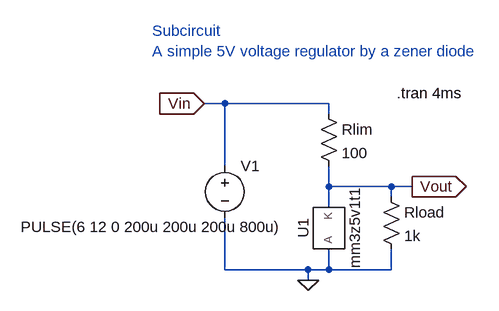
[diagram p0: schematic LTspice 06-2 Subcircuit.asc]
LTspice 06-2 Subcircuit.asc, the LTspice schematic file:
Version 4
SHEET 1 2152 1224
WIRE 368 192 336 192
WIRE 528 192 368 192
WIRE 528 208 528 192
WIRE 368 288 368 192
WIRE 528 320 528 288
WIRE 624 320 528 320
WIRE 656 320 624 320
WIRE 624 336 624 320
WIRE 528 352 528 320
WIRE 368 448 368 368
WIRE 496 448 368 448
WIRE 528 448 528 416
WIRE 528 448 496 448
WIRE 624 448 624 416
WIRE 624 448 528 448
WIRE 496 464 496 448
FLAG 496 464 0
FLAG 656 320 Vout
IOPIN 656 320 Out
FLAG 336 192 Vin
IOPIN 336 192 In
SYMBOL res 512 192 R0
SYMATTR InstName Rlim
SYMATTR Value 100
SYMBOL voltage 368 272 R0
WINDOW 3 -314 110 Left 2
WINDOW 123 0 0 Left 2
WINDOW 39 0 0 Left 2
SYMATTR Value PULSE(6 12 0 200u 200u 200u 800u)
SYMATTR InstName V1
SYMBOL res 608 320 R0
SYMATTR InstName Rload
SYMATTR Value 1k
SYMBOL mm3z5v1t1 528 384 R270
SYMATTR InstName U1
TEXT 256 80 Left 2 ;Subcircuit\nA simple 5V voltage regulator by a zener diode
TEXT 632 176 Left 2 !.tran 4ms

The netlist it stands for:
* LTspice 06-2 Subcircuit.asc
Rlim Vin Vout 100
V1 Vin 0 PULSE(6 12 0 200u 200u 200u 800u)
Rload Vout 0 1k
XU1 0 Vout mm3z5v1t1  ; pins A K
* Subcircuit
* A simple 5V voltage regulator by a zener diode
.tran 4ms
.lib MM3Z5V1LT1.LIB
.backanno
.end